# Altium schematic sheet Divider.SchDoc: LiveDesign Evaluation - Stop Watch
size A4; Organization: Altium Limited; Address1: L3, 12a Rodborough Rd; Address2: Frenchs Forest; Address3: NSW; Address4: Australia 2086; DocumentNumber: 2; SheetNumber: 2; SheetTotal: 7
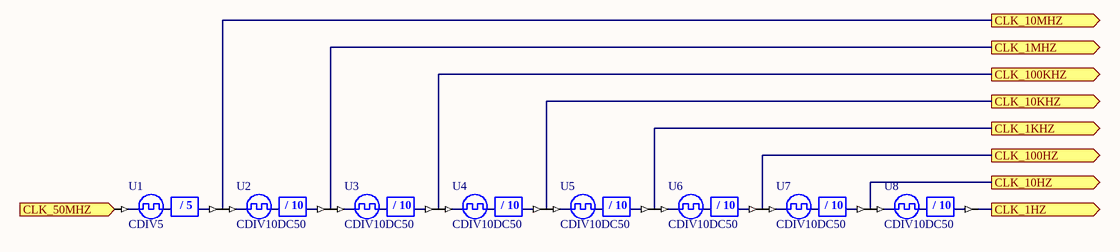
[diagram p0: Divider.SchDoc]

## Parts
U1  CDIV5
U2  CDIV10DC50
U3  CDIV10DC50
U4  CDIV10DC50
U5  CDIV10DC50
U6  CDIV10DC50
U7  CDIV10DC50
U8  CDIV10DC50

## Ports
CLK_1HZ (out), CLK_1KHZ (out), CLK_1MHZ (out), CLK_10HZ (out), CLK_10KHZ (out), CLK_10MHZ (out), CLK_50MHZ (in), CLK_100HZ (out), CLK_100KHZ (out)

## Nets
CLK_1HZ: U8.CLKDV ; port CLK_1HZ
CLK_1KHZ: U5.CLKDV U6.CLKIN ; port CLK_1KHZ
CLK_1MHZ: U2.CLKDV U3.CLKIN ; port CLK_1MHZ
CLK_10HZ: U7.CLKDV U8.CLKIN ; port CLK_10HZ
CLK_10KHZ: U4.CLKDV U5.CLKIN ; port CLK_10KHZ
CLK_10MHZ: U1.CLKDV U2.CLKIN ; port CLK_10MHZ
CLK_50MHZ: U1.CLKIN ; port CLK_50MHZ
CLK_100HZ: U6.CLKDV U7.CLKIN ; port CLK_100HZ
CLK_100KHZ: U3.CLKDV U4.CLKIN ; port CLK_100KHZ

## Notes on the sheet
- Title
- Size:
- Date:
- A4
- Number:
- Time:
- Revision:
- Sheet
- of
- File:
- (in symbol CDIV5) / 5
- (in symbol CDIV10DC50) / 10

## Library data of the parts
U1 = CDIV5: Clock Divider by 5; ArchiveName: GENERIC; VHDLIB_SIM: GENERIC_LIB; Published: 29-Jan-2004; Publisher: Altium Limited; Core Revision: 1.00.00
U2-U8 = CDIV10DC50: Clock Divider by 10 with 50% Duty Cycle Output; Xilinx Equivalent: CLK_DIV10; ArchiveName: GENERIC; VHDLIB_SIM: GENERIC_LIB; Published: 29-Jan-2004; Publisher: Altium Limited; Core Revision: 1.00.00